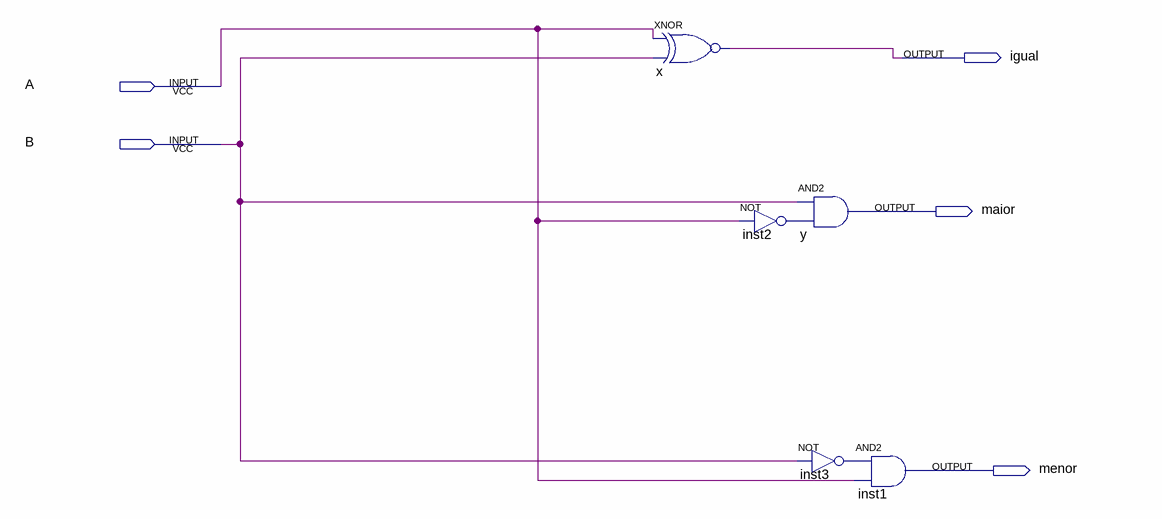
[diagram p0: schematic sheet]
// Quartus schematic decodificadorIgualador.bdf as structural Verilog: 5 symbols, 5 pins
module decodificadorIgualador (
  input  A,
  input  B,
  output igual,
  output maior,
  output menor
);

  wire inst2_out, inst3_out;

  xnor x (igual, A, B);
  and y (maior, B, inst2_out);
  not inst2 (inst2_out, A);
  not inst3 (inst3_out, B);
  and inst1 (menor, inst3_out, A);
endmodule
